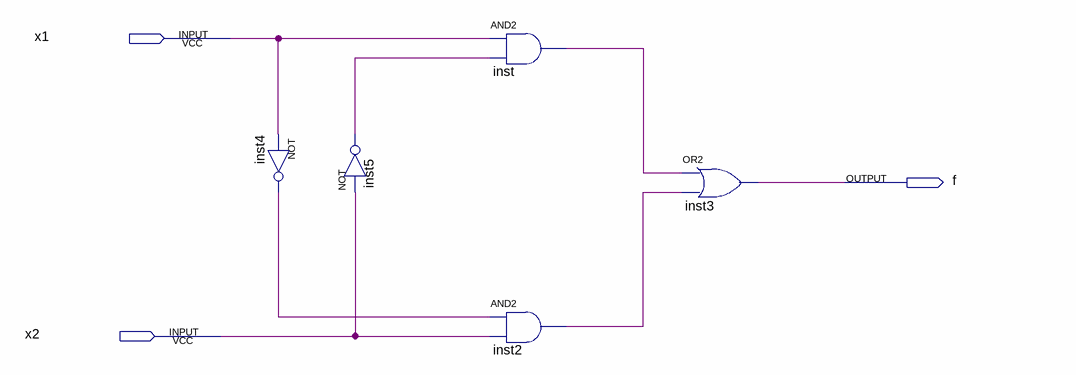
[diagram p0: schematic sheet]
// Quartus schematic light.bdf as structural Verilog: 5 symbols, 3 pins
module light (
  input  x1,
  input  x2,
  output f
);

  wire inst2_out, inst4_out, inst5_out, inst_out;

  not inst4 (inst4_out, x1);
  not inst5 (inst5_out, x2);
  and inst (inst_out, x1, inst5_out);
  and inst2 (inst2_out, inst4_out, x2);
  or inst3 (f, inst_out, inst2_out);
endmodule
